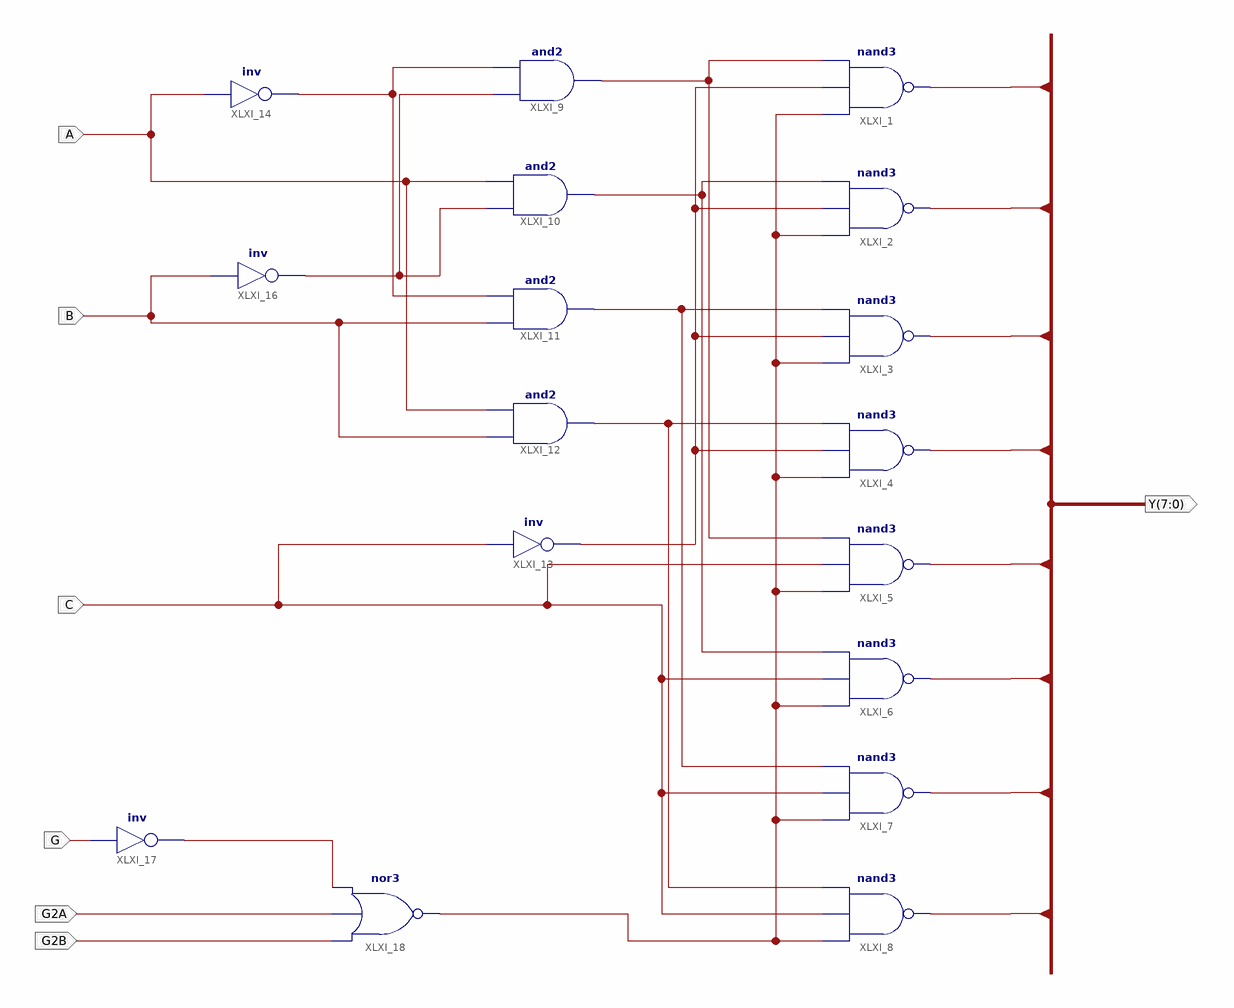
[diagram p0: schematic sheet 1]
// Xilinx ISE schematic D_74LS138.sch (kintex7) as structural Verilog: 17 symbols, 7 ports
module D_74LS138 (
  input  A,
  input  B,
  input  C,
  input  G,
  input  G2A,
  input  G2B,
  output [7:0] Y
);

  wire EN, NA, NB, NC, NG, XLXN_11, XLXN_13, XLXN_16, XLXN_18;

  nand XLXI_1 (Y[0], EN, NC, XLXN_11);
  nand XLXI_2 (Y[1], EN, NC, XLXN_13);
  nand XLXI_3 (Y[2], EN, NC, XLXN_16);
  nand XLXI_4 (Y[3], EN, NC, XLXN_18);
  nand XLXI_5 (Y[4], EN, C, XLXN_11);
  nand XLXI_6 (Y[5], EN, C, XLXN_13);
  nand XLXI_7 (Y[6], EN, C, XLXN_16);
  nand XLXI_8 (Y[7], EN, C, XLXN_18);
  and XLXI_9 (XLXN_11, NB, NA);
  and XLXI_10 (XLXN_13, NB, A);
  and XLXI_11 (XLXN_16, B, NA);
  and XLXI_12 (XLXN_18, B, A);
  not XLXI_13 (NC, C);
  not XLXI_14 (NA, A);
  not XLXI_16 (NB, B);
  not XLXI_17 (NG, G);
  nor XLXI_18 (EN, G2B, G2A, NG);
endmodule
